# Altium schematic sheet LoRa-Alarm.SchDoc
size A3; PageSetup: Record=PageOptions|CenterHorizontal=True|CenterVertical=True|PrintScale=0.65|XCorrection=1.00|YCorrection=1.00|PrintKind=1|BorderSize=5000000|LeftOffset=0|BottomOffset=0|Orientation=2|PaperLength=1000|PaperWidth=1000|Scale=100|PaperSource=15|PrintQuality=300|MediaType=1|DitherType=10|PrintScaleMode=1|PaperKind=A4|PaperIndex=9
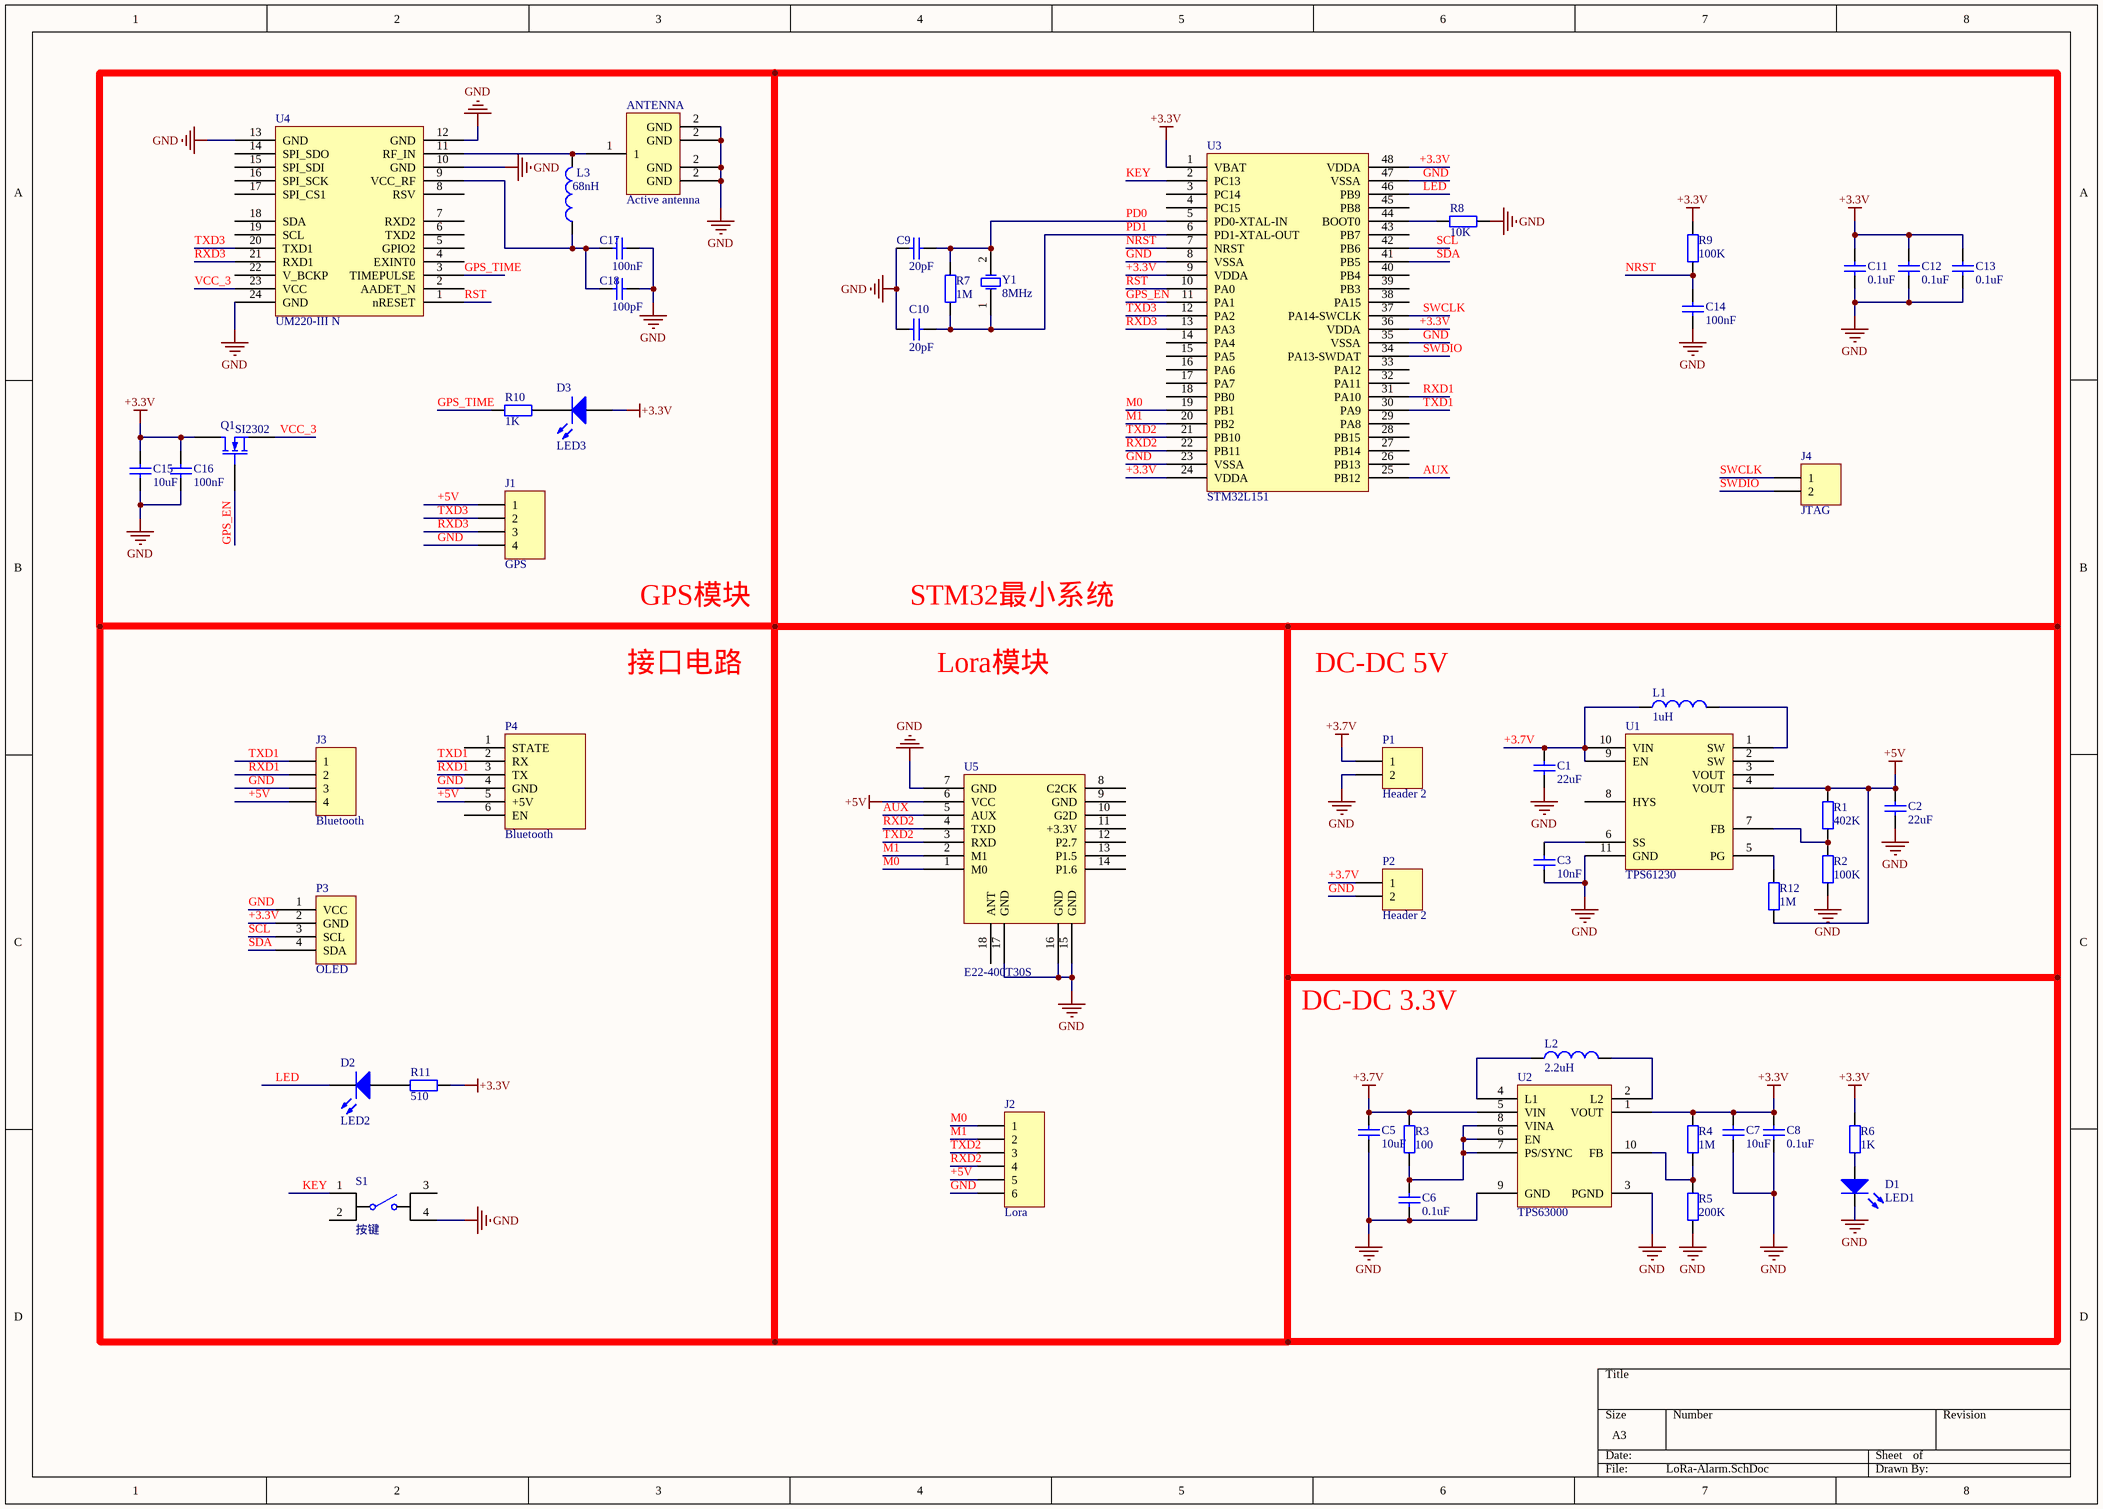
[diagram p0: LoRa-Alarm.SchDoc]

## Parts
ANTENNA  Active antenna  [SMA-W]
C1  value 22uF  [0603C]  (hidden comment: Cap1)
C2  value 22uF  [0603C]  (hidden comment: Cap2)
C3  value 10nF  [0603C]  (hidden comment: Cap3)
C5  value 10uF  [0603C]  (hidden comment: Cap5)
C6  value 0.1uF  [0603C]  (hidden comment: Cap6)
C7  value 10uF  [0603C]  (hidden comment: Cap7)
C8  value 0.1uF  [0603C]  (hidden comment: Cap8)
C9  value 20pF  [0603C]  (hidden comment: Cap9)
C10  value 20pF  [0603C]  (hidden comment: Cap10)
C11  value 0.1uF  [0603C]  (hidden comment: Cap11)
C12  value 0.1uF  [0603C]  (hidden comment: Cap12)
C13  value 0.1uF  [0603C]  (hidden comment: Cap13)
C14  value 100nF  [0603C]  (hidden comment: Cap14)
C15  value 10uF  [0603C]  (hidden comment: Cap15)
C16  value 100nF  [0603C]  (hidden comment: Cap16)
C17  value 100nF  [0603C]  (hidden comment: Cap17)
C18  value 100pF  [0603C]  (hidden comment: Cap18)
D1  LED1  [贴片二极管]
D2  LED2  [贴片二极管]
D3  LED3  [贴片二极管]
J1  GPS  [HDR1X4]
J2  Lora  [HDR1X6]
J3  Bluetooth  [HDR1X4]
J4  JTAG  [HDR1X2]
L1  value 1uH  [IND-SMD_L4.0-W4.0_SMNR4020]  (hidden comment: Inductor1)
L2  value 2.2uH  [IND-SMD_L4.0-W4.0_SMNR4020]  (hidden comment: Inductor2)
L3  value 68nH  [0603L]  (hidden comment: Inductor3)
P1  Header 2  [HDR1X2]
P2  Header 2  [HDR1X2]
P3  OLED  [SIP4]
P4  Bluetooth  [SIP6]
Q1  SI2302  [SOT-23]
R1  value 402K  [0603R]  (hidden comment: Res1)
R2  value 100K  [0603R]  (hidden comment: Res2)
R3  value 100  [0603R]  (hidden comment: Res3)
R4  value 1M  [0603R]  (hidden comment: Res4)
R5  value 200K  [0603R]  (hidden comment: Res5)
R6  value 1K  [0603R]  (hidden comment: Res6)
R7  value 1M  [0603R]  (hidden comment: Res7)
R8  value 10K  [0603R]  (hidden comment: Res8)
R9  value 100K  [0603R]  (hidden comment: Res9)
R10  value 1K  [0603R]  (hidden comment: Res10)
R11  value 510  [0603R]  (hidden comment: Res11)
R12  value 1M  [0603R]  (hidden comment: Res12)
S1  按键  [KEY-SMD_4P-L6.0-W6.0-P3.90-LS10.0]
U1  TPS61230  [VSON-10_L3.0-W3.0-P0.50-BL-EP]
U2  TPS63000  [SON-10_L3.1-W3.1-P0.50-BL-EP]
U3  STM32L151  [TQFP48]
U4  UM220-III N  [UM220-III N]
U5  E22-400T30S  [PE32(915T30S)]
Y1  8MHz  [XTAL]

## Nets
+3.3V: C7.2 C8.2 C11.1 C12.1 C13.1 C15.1 C16.1 D3.1(A) P3.2(GND) Q1.1(D) R4.2 R6.2 R9.2 R11.1 U2.1(VOUT) U3.1(VBAT) U3.9(VDDA) U3.24(VDDA) U3.36(VDDA) U3.48(VDDA)
+3.7V: C1.2 C5.2 L1.1 P1.1 P2.1 R3.2 U1.9(EN) U1.10(VIN) U2.5(VIN)
+5V: C2.2 J1.1 J2.5 J3.4 P4.5(+5V) R1.2 R12.1 U1.4(VOUT) U5.6(VCC)
GND: ANTENNA.2(GND) C1.1 C2.1 C3.1 C5.1 C6.1 C7.1 C8.1 C9.2 C10.2 C11.2 C12.2 C13.2 C14.2 C15.2 C16.2 C17.2 C18.2 D1.2(K) J1.4 J2.6 J3.3 P1.2 P2.2 P3.1(VCC) P4.4(GND) R2.1 R5.1 R8.2 S1.4(COMMON) U1.11(GND) U2.3(PGND) U2.9(GND) U3.8(VSSA) U3.23(VSSA) U3.35(VSSA) U3.47(VSSA) U4.10(GND) U4.12(GND) U4.13(GND) U4.24(GND) U5.7(GND) U5.15(GND) U5.16(GND) U5.17(GND)
AUX: U3.25(PB12) U5.5(AUX)
GPS_EN: Q1.2(G) U3.11(PA1)
GPS_TIME: R10.2 U4.3(TIMEPULSE)
KEY: S1.1(COMMON) U3.2(PC13)
LED: D2.2(K) U3.46(PB9)
M0: J2.1 U3.19(PB1) U5.1(M0)
M1: J2.2 U3.20(PB2) U5.2(M1)
NRST: C14.1 R9.1 U3.7(NRST)
PD0: C9.1 R7.2 U3.5(PD0-XTAL-IN) Y1.2(OSC2)
PD1: C10.1 R7.1 U3.6(PD1-XTAL-OUT) Y1.1(OSC1)
RST: U3.10(PA0) U4.1(nRESET)
RXD1: J3.2 P4.3(TX) U3.31(PA10)
RXD2: J2.4 U3.22(PB11) U5.4(TXD)
RXD3: J1.3 U3.13(PA3) U4.21(RXD1)
SCL: P3.3(SCL) U3.42(PB6)
SDA: P3.4(SDA) U3.41(PB5)
SWCLK: J4.1 U3.37(PA14-SWCLK)
SWDIO: J4.2 U3.34(PA13-SWDAT)
TXD1: J3.1 P4.2(RX) U3.30(PA9)
TXD2: J2.3 U3.21(PB10) U5.3(RXD)
TXD3: J1.2 U3.12(PA2) U4.20(TXD1)
VCC_3: Q1.3(S) U4.23(VCC)
NetANTENNA_1: ANTENNA.1 L3.2 U4.11(RF_IN)
NetC3_2: C3.2 U1.6(SS)
NetC6_2: C6.2 R3.1 U2.6(EN) U2.7(PS/SYNC) U2.8(VINA)
NetC17_1: C17.1 C18.1 L3.1 U4.9(VCC_RF)
NetD1_1: D1.1(A) R6.1
NetD2_1: D2.1(A) R11.2
NetD3_2: D3.2(K) R10.1
NetL1_2: L1.2 U1.1(SW)
NetL2_1: L2.1 U2.4(L1)
NetL2_2: L2.2 U2.2(L2)
NetR1_1: R1.1 R2.2 U1.7(FB)
NetR4_1: R4.1 R5.2 U2.10(FB)
NetR8_1: R8.1 U3.44(BOOT0)
NetR12_2: R12.2 U1.5(PG)

Not connected (* = marked no-connect by the designer): P4 1(STATE) 6(EN); S1 2(COMMON) 3; U1 2(SW) 3(VOUT) 8(HYS); U3 3(PC14) 4(PC15) 14(PA4) 15(PA5) 16(PA6) 17(PA7) 18(PB0) 26(PB13) 27(PB14) 28(PB15) 29(PA8) 32(PA11) 33(PA12) 38(PA15) 39(PB3) 40(PB4) 43(PB7) 45(PB8); U4 2(AADET_N) 4(EXINT0) 5(GPIO2) 6(TXD2) 7(RXD2) 8(RSV) 14(SPI_SDO) 15(SPI_SDI) 16(SPI_SCK) 17(SPI_CS1) 18(SDA) 19(SCL) 22(V_BCKP); U5 8(C2CK) 9(GND) 10(G2D) 11(+3.3V) 12(P2.7) 13(P1.5) 14(P1.6) 18(ANT)

## Notes on the sheet
- GPS模块
- STM32最小系统
- 接口电路
- Lora模块
- DC-DC 5V
- DC-DC 3.3V

## Library data of the parts
C1-C3 C5-C18 = Cap: Capacitor; Published: 8-Jun-2000; LatestRevisionDate: 17-Jul-2002; LatestRevisionNote: Re-released for DXP Platform.; PackageReference: RAD-0.3; Publisher: Altium Limited; PackageDescription: Radial Cap, Thru-Hole; 2 Leads; 0.3 in Pin Spacing
D1-D3 = LED1: Typical RED GaAs LED; Published: 8-Jun-2000; LatestRevisionDate: 08-Jul-2005; LatestRevisionNote: Mech Layer 1 removed.; PackageReference: LED-1; Publisher: Altium Limited; PackageDescription: LED; 2 Leads
J1 J3 = Header 4: Header, 4-Pin; LatestRevisionDate: 17-Jul-2002; LatestRevisionNote: Re-released for DXP Platform.; Publisher: Altium Limited
J2 = Header 6: Header, 6-Pin; LatestRevisionDate: 17-Jul-2002; LatestRevisionNote: Re-released for DXP Platform.; Publisher: Altium Limited
J4 P1 P2 = Header 2: Header, 2-Pin; LatestRevisionDate: 17-Jul-2002; LatestRevisionNote: Re-released for DXP Platform.; Publisher: Altium Limited
L1-L3 = Inductor: Code_IEC: 1005; Published: 8-Jun-2000; LatestRevisionDate: 29-May-2009; LatestRevisionNote: IPC-7351 Footprint Added.; PackageReference: 0402-A; Publisher: Altium Limited; PackageDescription: Chip Inductor; Code_JEITA: 0402
Q1 = MOSFET-N: N-Channel MOSFET; Published: 8-Jun-2000; LatestRevisionDate: 17-Jul-2002; LatestRevisionNote: Re-released for DXP Platform.; PackageVersion: 1995/1996; PackageReference: E3; Publisher: Altium Limited; PackageDescription: TO, Flat Index; 3 In-Line, Axial Leads; Body Dia. 4.6mm; Lead Dia. 0.5 mm (max)
R1-R12 = Res2: Resistor; Published: 8-Jun-2000; LatestRevisionDate: 17-Jul-2002; LatestRevisionNote: Re-released for DXP Platform.; PackageReference: AXIAL-0.4; Publisher: Altium Limited; PackageDescription: Axial Device, Thru-Hole; 2 Leads; 0.4 in Pin Spacing
Y1 = XTAL: Crystal Oscillator; Published: 8-Jun-2000; LatestRevisionDate: 17-Jul-2002; LatestRevisionNote: Re-released for DXP Platform.; PackageReference: R38; Publisher: Altium Limited; PackageDescription: Crystal, Thru-Hole; 2 Leads; Body 3.1 x 8.2 mm (Dia.xH)